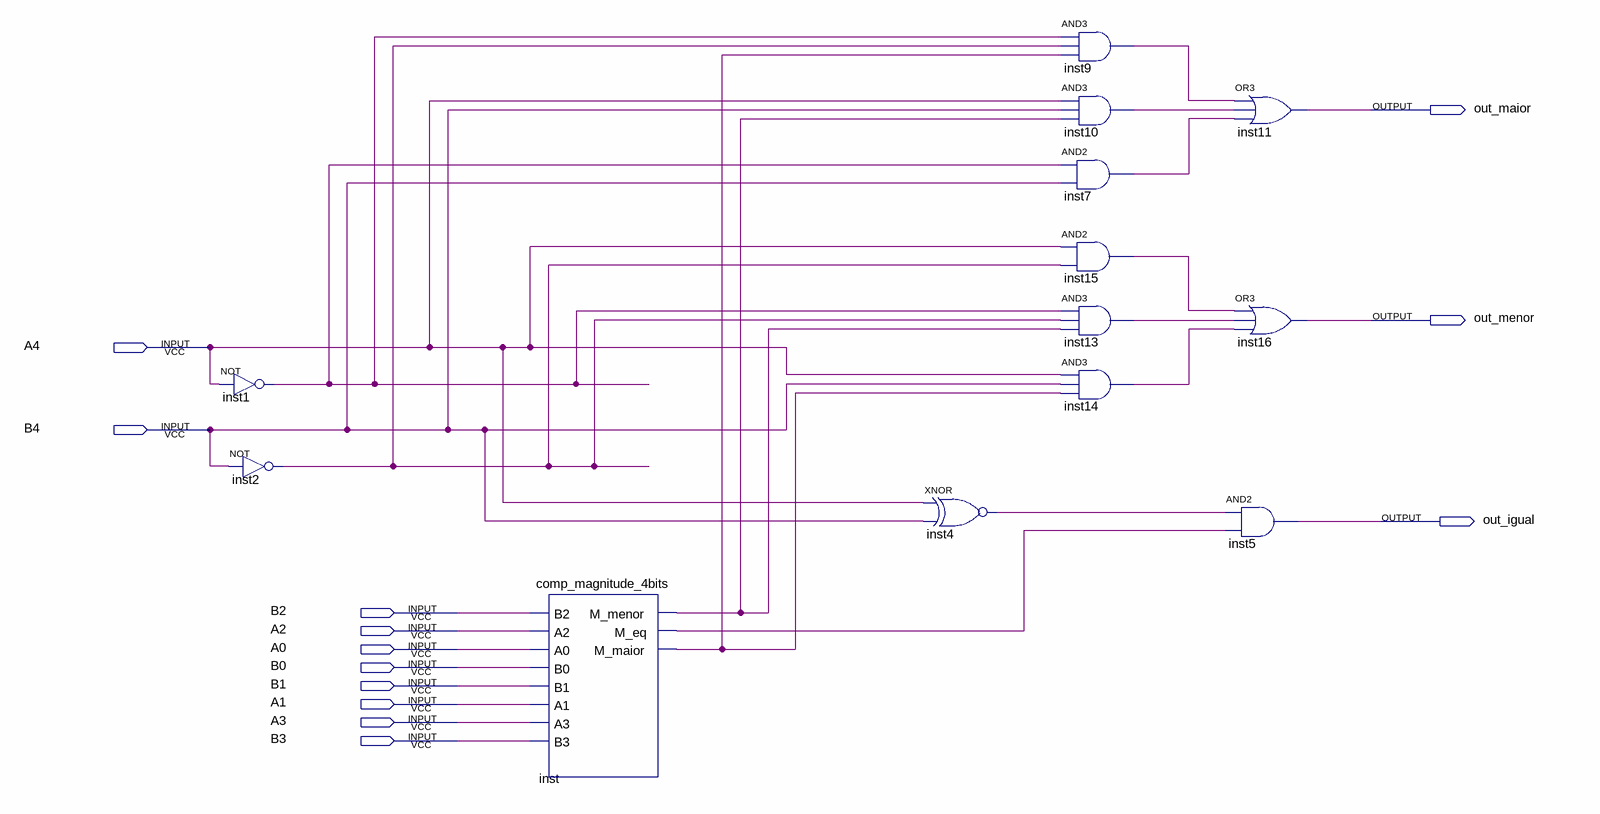
[diagram p0: schematic sheet]
// Quartus schematic comparador_completo.bdf as structural Verilog: 13 symbols, 13 pins
module comparador_completo (
  input  A4,
  input  B4,
  input  B2,
  input  A2,
  input  A0,
  input  B0,
  input  B1,
  input  A1,
  input  A3,
  input  B3,
  output out_maior,
  output out_menor,
  output out_igual
);

  wire inst1_out, inst2_out, inst4_out, inst7_out, inst9_out, inst10_out, inst13_out, inst14_out, inst15_out,
       inst_m_eq, inst_m_maior, inst_m_menor;

  not inst1 (inst1_out, A4);
  not inst2 (inst2_out, B4);
  comp_magnitude_4bits inst (
    .B2(B2), .A2(A2), .A0(A0), .B0(B0), .B1(B1), .A1(A1), .A3(A3), .B3(B3), .M_menor(inst_m_menor),
    .M_eq(inst_m_eq), .M_maior(inst_m_maior));
  xnor inst4 (inst4_out, A4, B4);
  and inst9 (inst9_out, inst1_out, inst2_out, inst_m_maior);
  and inst10 (inst10_out, A4, B4, inst_m_menor);
  and inst7 (inst7_out, inst1_out, B4);
  and inst15 (inst15_out, A4, inst2_out);
  and inst13 (inst13_out, inst1_out, inst2_out, inst_m_menor);
  and inst14 (inst14_out, A4, B4, inst_m_maior);
  and inst5 (out_igual, inst4_out, inst_m_eq);
  or inst11 (out_maior, inst9_out, inst10_out, inst7_out);
  or inst16 (out_menor, inst15_out, inst13_out, inst14_out);
endmodule
